# Altium schematic sheet Isolated_Oscilloscope_Diferential_Probe.SchDoc: Low Noise Oscilloscope Amplifier (part 2 of 2)
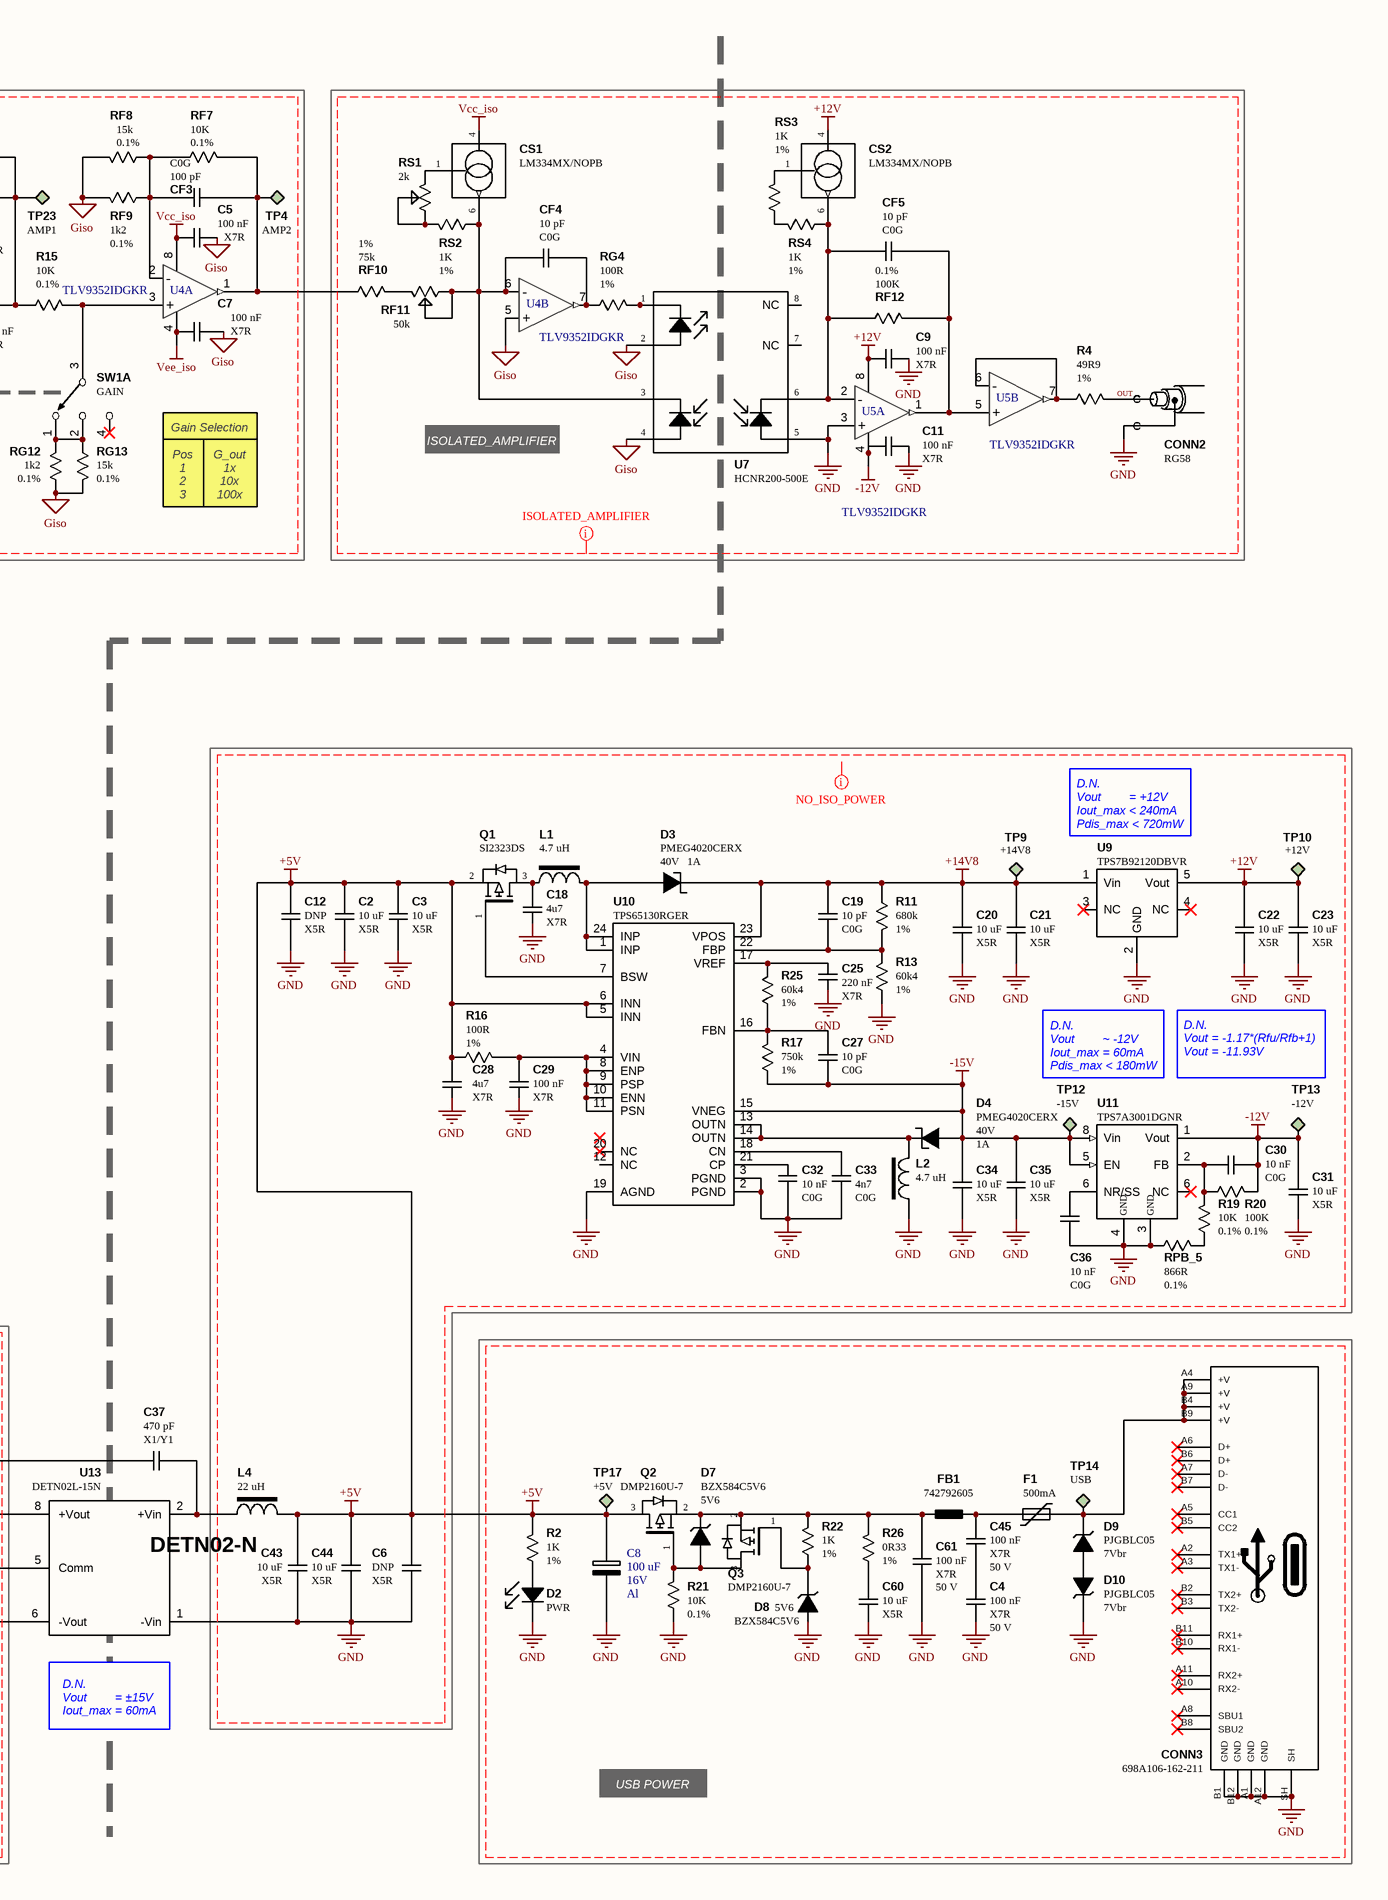
[diagram p2: Isolated_Oscilloscope_Diferential_Probe.SchDoc, right]

## Library data of the parts
C1 C4 C5 C7 C9-C11 C14 C16 C29 C45 C58 C59 C61 CF1 = Capacitor NP: 0.1 µF ±10% 50V Ceramic Capacitor X7R 0603 (1608 Metric); 04_Manufacturer Part Number: CC0603KRX7R9BB104; 06_Manufacturer: YAGEO; 01_Componente: Capacitor cerámico; 02_Montaje: SMD; 03_Encapsulado: 0603; 05_Digikey Part Number: 311-1344-1-ND; ComponentLink1Description: A_Datasheet; ComponentLink1URL: https://yageogroup.com/content/datasheet/asset/file/UPY-GPHC_X7R_6_3V-TO-250V; ComponentLink2Description: B_Digikey; Valor: 100 nF; Tolerancia: 10%
  C1 C5 C7 C9 C11 C14 C16 C29 C58 C59 CF1: ComponentLink2URL: https://www.digikey.com/en/products/detail/yageo/CC0603KRX7R9BB104/2103082?s=N4IgTCBcDaIMwEYEFoFwCztcgcgERAF0BfIA; Tensión: 50 V
  C4 C45 C61: ComponentLink2URL: https://www.digikey.com/en/products/detail/yageo/CC0603KRX7R9BB104/2103082?s=N4IgTCBcDaIMwEYEFoFwCztcgcgERAF0BfIA
  C10: ComponentLink2URL: https://www.digikey.com/en/products/detail/yageo/CC0603KRX7R9BB104/2103082?s=N4IgTCBcDaIMJwAwDZEGYDSAlAGgdiwE4AhYgRkQBYQBdAXyA; Tensión: 50 V
C2 C3 C20-C23 C31 C34 C35 C38 C39 C41 C43 C44 C47 C51-C54 C60 = Capacitor NP: 10 µF ±10% 50V Ceramic Capacitor X5R 0805 (2012 Metric); 04_Manufacturer Part Number: GRM21BR61H106KE43L; 06_Manufacturer: Murata Electronics; 01_Componente: Capacitor cerámico; 02_Montaje: SMD; 03_Encapsulado: 0805; 05_Digikey Part Number: 490-18663-1-ND; ComponentLink1Description: A_Datasheet; ComponentLink1URL: https://search.murata.co.jp/Ceramy/image/img/A01X/G101/ENG/GRM21BR61H106KE43-01A.pdf; ComponentLink2Description: B_Digikey; ComponentLink2URL: https://www.digikey.com/en/products/detail/murata-electronics/GRM21BR61H106KE43L/10326316; Valor: 10 uF; Tolerancia: 10%; Tensión: 50 V
C6 C12 = Capacitor NP: 10 µF ±10% 50V Ceramic Capacitor X5R 0805 (2012 Metric); 04_Manufacturer Part Number: GRM21BR61H106KE43L; 06_Manufacturer: Murata Electronics; 01_Componente: Capacitor cerámico; 02_Montaje: SMD; 03_Encapsulado: 0805; Valor: 10 uF; 05_Digikey Part Number: 490-18663-1-ND; ComponentLink1Description: A_Datasheet; ComponentLink1URL: https://search.murata.co.jp/Ceramy/image/img/A01X/G101/ENG/GRM21BR61H106KE43-01A.pdf; ComponentLink2Description: B_Digikey; ComponentLink2URL: https://www.digikey.com/en/products/detail/murata-electronics/GRM21BR61H106KE43L/10326316; Tolerancia: 10%; Tensión: 50 V
C8 = Capacitor Polarizado: 04_Manufacturer Part Number: 875105344010; 06_Manufacturer: Würth Elektronik; 02_Montaje: SMD; 03_Encapsulado: 6.6mmx6.6mmx5.8mm; Tolerancia: 20%; 01_Componente: Capacitor Polarizado; 05_Digikey Part Number: 732-6425-1-ND; ComponentLink1Description: A_Datasheet; ComponentLink1URL: https://www.we-online.com/components/products/datasheet/875105344010.pdf; ComponentLink2Description: B_Digikey; ComponentLink2URL: https://www.digikey.com/en/products/detail/würth-elektronik/875105344010/5147589; Valor: 100 uF
C13 C15 C17 C24 C26 C40 C50 = Capacitor NP: 04_Manufacturer Part Number: CC0805JKX7R9BB105; 06_Manufacturer: YAGEO; 01_Componente: Capacitor cerámico; 02_Montaje: SMD; 03_Encapsulado: 0805; Tolerancia: 10%; Tensión: 50V; 05_Digikey Part Number: 311-3498-1-ND; ComponentLink1Description: A_Datasheet; ComponentLink2Description: B_Digikey; Valor: 1 uF
  C13: ComponentLink1URL: https://www.yageo.com/en/Chart/Download/pdf/CC0603GRNPO9BN101; ComponentLink2URL: https://www.digikey.com/en/products/detail/yageo/CC0603GRNPO9BN101/5883538?s=N4IgTCBcDaIMJwAwDZEGYDiAlAcgBQHkBOAIRwEZFyQBdAXyA
  C15 C17 C24 C26 C40 C50: ComponentLink1URL: https://yageogroup.com/content/datasheet/asset/file/UPY-GPHC_X7R_6_3V-TO-250V; ComponentLink2URL: https://www.digikey.com/en/products/detail/yageo/CC0805JKX7R9BB105/7164382
C18 C28 C42 C46 = Capacitor NP: 4.7 µF ±20% 50V Ceramic Capacitor X7R 0805 (2012 Metric); 04_Manufacturer Part Number: GRM21BZ71H475ME15K; 06_Manufacturer: Murata Electronics; 01_Componente: Capacitor cerámico; 02_Montaje: SMD; 03_Encapsulado: 0805; 05_Digikey Part Number: 490-GRM21BZ71H475ME15KCT-ND; ComponentLink1Description: A_Datasheet; ComponentLink1URL: https://search.murata.co.jp/Ceramy/image/img/A01X/G101/ENG/GRM21BZ71H475ME15-01.pdf; ComponentLink2Description: B_Digikey; ComponentLink2URL: https://www.digikey.com/en/products/detail/murata-electronics/GRM21BZ71H475ME15K/13904866?s=N4IgTCBcDaIOICUCyYCMAhAWgdlQCQBZsBWJAUVWIGkQBdAXyA; Valor: 4u7; Tolerancia: 20%; Tensión: 50 V
C19 C27 CF4 CF5 = Capacitor NP: 10 pF ±5% 50V Ceramic Capacitor C0G, NP0 0603 (1608 Metric); 04_Manufacturer Part Number: CC0603JRNPO9BN100; 06_Manufacturer: YAGEO; 01_Componente: Capacitor cerámico; 02_Montaje: SMD; 03_Encapsulado: 0603; 05_Digikey Part Number: 311-1058-1-ND; ComponentLink1Description: A_Datasheet; ComponentLink2Description: B_Digikey; Valor: 10 pF; Tolerancia: 5%
  C19 C27: ComponentLink1URL: https://www.yageo.com/en/Chart/Download/pdf/CC0603JRNPO9BN100; ComponentLink2URL: https://www.digikey.com/en/products/detail/yageo/CC0603JRNPO9BN100/302792; Tensión: 50V
  CF4: ComponentLink1URL: https://www.yageo.com/en/Chart/Download/pdf/CC0603JRNPO9BN100; ComponentLink2URL: https://www.digikey.com/en/products/detail/yageo/CC0603JRNPO9BN100/302792; Tensión: 50 V
  CF5: ComponentLink1URL: https://yageogroup.com/content/datasheet/asset/file/UPY-GPHC_X7R_6_3V-TO-250V; ComponentLink2URL: https://www.digikey.com/en/products/detail/yageo/CC0603KRX7R9BB104/2103082?s=N4IgTCBcDaIMwEYEFoFwCztcgcgERAF0BfIA; Tensión: 50 V
C25 = Capacitor NP: 0.22 µF ±10% 25V Ceramic Capacitor X7R 0603 (1608 Metric); 04_Manufacturer Part Number: CC0603KRX7R8BB224; 06_Manufacturer: YAGEO; 01_Componente: Capacitor cerámico; 02_Montaje: SMD; 03_Encapsulado: 0603; Tensión: 50V; 05_Digikey Part Number: 311-1803-1-ND; ComponentLink1Description: A_Datasheet; ComponentLink1URL: https://yageogroup.com/content/datasheet/asset/file/UPY-GPHC_X7R_6_3V-TO-250V; ComponentLink2Description: B_Digikey; ComponentLink2URL: https://www.digikey.com/en/products/detail/yageo/CC0603KRX7R8BB224/5195211; Valor: 220 nF; Tolerancia: 10%
C30 C32 C36 C48 C49 CF_2 CF_6 = Capacitor NP: 10000 pF ±5% 50V Ceramic Capacitor C0G, NP0 0603 (1608 Metric); 04_Manufacturer Part Number: GRM1885C1H103JA01D; 06_Manufacturer: Murata Electronics; 01_Componente: Capacitor cerámico; 02_Montaje: SMD; 03_Encapsulado: 0603; 05_Digikey Part Number: 490-9666-1-ND; ComponentLink1Description: A_Datasheet; ComponentLink1URL: https://search.murata.co.jp/Ceramy/image/img/A01X/G101/ENG/GRM1885C1H103JA01-01.pdf; ComponentLink2Description: B_Digikey; Valor: 10 nF; Tolerancia: 5%; Tensión: 50V
  C30 C32 C36 C48 C49 CF_2: ComponentLink2URL: https://www.digikey.com/en/products/detail/murata-electronics/GRM1885C1H103JA01D/4421555?s=N4IgTCBcDaIOICUCyBGAHGgrAYRQCRQAYBmAKQEFCUAREAXQF8g
  CF_6: ComponentLink2URL: https://www.digikey.com/en/products/detail/murata-electronics/GRM1885C1H103JA01D/4421555
C33 = Capacitor NP: 4700 pF ±1% 50V Ceramic Capacitor C0G, NP0 0603 (1608 Metric); 04_Manufacturer Part Number: CC0603FRNPO9BN472; 06_Manufacturer: YAGEO; 01_Componente: Capacitor cerámico; 02_Montaje: SMD; 03_Encapsulado: 0603; 05_Digikey Part Number: 13-CC0603FRNPO9BN472CT-ND; ComponentLink1Description: A_Datasheet; ComponentLink1URL: https://www.yageo.com/en/Chart/Download/pdf/CC0603FRNPO9BN472; ComponentLink2Description: B_Digikey; ComponentLink2URL: https://www.digikey.com/en/products/detail/yageo/CC0603FRNPO9BN472/16797641; Valor: 4n7; Tolerancia: 1%; Tensión: 50V
C37 = Capacitor NP: 470 pF ±10% 1500V (1.5kV) Ceramic Capacitor B Radial, Disc; 04_Manufacturer Part Number: DE1B3RA471KN4AP01F; 06_Manufacturer: Murata Electronics; 01_Componente: Capacitor cerámico; 02_Montaje: THT; 03_Encapsulado: Radial Disc; 05_Digikey Part Number: 490-16186-1-ND; ComponentLink1Description: A_Datasheet; ComponentLink1URL: https://pim.murata.com/asset/pim4/ceramicCapacitorLead/DE1_RA_P01F_E_PDF_CERAMICCAPACITORLEAD?lastModifiedDatetime=20250909130219; ComponentLink2Description: B_Digikey; ComponentLink2URL: https://www.digikey.com/en/products/detail/murata-electronics/DE1B3RA471KN4AP01F/7319165; Valor: 470 pF; Tolerancia: 10%; Tensión: 1.5 kV
CA_1 CA_2 CB_1 CB_2 = Capacitor NP: -55℃~+105℃ 100V 4.7uF Metallized Polyester ±5% 插件,P=15mm Film Capacitors ROHS; 04_Manufacturer Part Number: C232A475J6SC000; 06_Manufacturer: XIAMEN FARATRONIC; 01_Componente: Capacitor cerámico; 02_Montaje: THT; 03_Encapsulado: NE; 05_Digikey Part Number: NE; ComponentLink1Description: A_Datasheet; ComponentLink2Description: B_Digikey; Valor: 4u7
  CA_1 CB_1 CB_2: ComponentLink1URL: https://www.yageo.com/en/Chart/Download/pdf/CC0603GRNPO9BN101; ComponentLink2URL: https://www.digikey.com/en/products/detail/yageo/CC0603GRNPO9BN101/5883538?s=N4IgTCBcDaIMJwAwDZEGYDiAlAcgBQHkBOAIRwEZFyQBdAXyA
  CA_2: ComponentLink1URL: https://jlcpcb.com/api/file/downloadByFileSystemAccessId/8588897352174211072
CAB1 = Capacitor NP: 5.6 pF ±0.5pF 50V Ceramic Capacitor C0G, NP0 0603 (1608 Metric); 04_Manufacturer Part Number: CC0603DRNPO9BN5R6; 06_Manufacturer: YAGEO; 01_Componente: Capacitor cerámico; 02_Montaje: SMD; 03_Encapsulado: 0603; Tolerancia: 10%; 05_Digikey Part Number: 311-3872-1-ND; ComponentLink1Description: A_Datasheet; ComponentLink1URL: https://www.yageo.com/en/Chart/Download/pdf/CC0603DRNPO9BN5R6; ComponentLink2Description: B_Digikey; ComponentLink2URL: https://www.digikey.com/en/products/detail/yageo/CC0603DRNPO9BN5R6/5883475; Valor: 5.6 pF; Tensión: 50V
CF2 CF3 CF_3 CF_4 = Capacitor NP: 04_Manufacturer Part Number: CC0603GRNPO9BN101; 06_Manufacturer: YAGEO; 01_Componente: Capacitor cerámico; 02_Montaje: SMD; 03_Encapsulado: 0603; Tolerancia: 2%; Tensión: 50V; 05_Digikey Part Number: 311-3351-1-ND; ComponentLink1Description: A_Datasheet; ComponentLink1URL: https://www.yageo.com/en/Chart/Download/pdf/CC0603GRNPO9BN101; ComponentLink2Description: B_Digikey; ComponentLink2URL: https://www.digikey.com/en/products/detail/yageo/CC0603GRNPO9BN101/5883538?s=N4IgTCBcDaIMJwAwDZEGYDiAlAcgBQHkBOAIRwEZFyQBdAXyA
  CF2 CF3 CF_4: Valor: 100 pF
  CF_3: Valor: 100n
CF_1 CF_5 = Capacitor NP: 1000 pF ±2% 50V Ceramic Capacitor C0G, NP0 0603 (1608 Metric); 04_Manufacturer Part Number: CC0603GRNPO9BN102; 06_Manufacturer: YAGEO; 01_Componente: Capacitor cerámico; 02_Montaje: SMD; 03_Encapsulado: 0603; 05_Digikey Part Number: 311-3916-1-ND; ComponentLink1Description: A_Datasheet; ComponentLink1URL: https://www.yageo.com/en/Chart/Download/pdf/CC0603GRNPO9BN102; ComponentLink2Description: B_Digikey; Valor: 1 nF; Tolerancia: 2%; Tensión: 50V
  CF_1: ComponentLink2URL: https://www.digikey.com/en/products/detail/yageo/CC0603GRNPO9BN102/5883539?s=N4IgTCBcDaIMwEYEFo4E4EDZkoHIBEQBdAXyA
  CF_5: ComponentLink2URL: https://www.digikey.com/en/products/detail/yageo/CC0603GRNPO9BN102/5883539?s=N4IgTCBcDaIMJwAwDZEGYDiAlAcgBQHkBOAIRwEZEIBdAXyA
CMRR_AC = Trimpot: 200 kOhms 0.125W, 1/8W J Lead Surface Mount Trimmer Potentiometer Cermet 11.0 Turn Top Adjustment; 04_Manufacturer Part Number: 3223W-1-204E; 06_Manufacturer: Bourns Inc.; 02_Montaje: SMD; 03_Encapsulado: J-LEAD; Tolerancia: 10%; 01_Componente: Trimpot; 05_Digikey Part Number: 3223W-1-204ECT-ND; ComponentLink1Description: A_Datasheet; ComponentLink1URL: https://www.bourns.com/docs/Product-Datasheets/3223.pdf; ComponentLink2Description: B_Digikey; ComponentLink2URL: https://www.digikey.com/en/products/detail/bourns-inc/3223W-1-204E/568954; Valor: 200k
CONN1 = Conector BNC: BNC Connector Jack, Female Socket 50 Ohms Panel Mount, Through Hole, Right Angle Solder; 06_Manufacturer: TE Connectivity Linx; 02_Montaje: SMD; Contactos: 2; Valor: 50 Ohm; 01_Componente: Conector BNC; 03_Encapsulado: BNC; 04_Manufacturer Part Number: CONBNC002; 05_Digikey Part Number: 343-CONBNC002-ND; ComponentLink1Description: A_Datasheet; ComponentLink1URL: https://www.te.com/commerce/DocumentDelivery/DDEController?Action=srchrtrv&DocNm=CONBNC002&DocType=Data+Sheet&DocLang=English&DocFormat=pdf&PartCntxt=CONBNC002; ComponentLink2Description: B_Digikey; ComponentLink2URL: https://www.digikey.com/en/products/detail/te-connectivity-linx/CONBNC002/16013841
CONN2 = RG58_Coaxial_Cable: Cable RG58 Soldado directo a PCB
CONN3 = USB C 3.0: USB-C (USB TYPE-C) USB 3.2 Gen 2 (USB 3.1 Gen 2, Superspeed + (USB 3.1)) Receptacle Connector 24 (6+18 Dummy) Position Surface Mount, Right Angle; 06_Manufacturer: Molex; 01_Componente: Conector USB C; 02_Montaje: SMD; 03_Encapsulado: USB C; Contactos: 24; TH_Paso: 0.50mm; 04_Manufacturer Part Number: 1054500101; 05_Digikey Part Number: WM12856CT-ND; ComponentLink1Description: A_Datasheet; ComponentLink1URL: https://files.edac.net/edac/content/698A/698A106-162-211%20-%20EDAC%20USB%20Connector.pdf; ComponentLink2Description: B_Digikey; ComponentLink2URL: https://www.digikey.com/en/products/detail/edac-inc/698A106-162-211/17186068
CS1 CS2 = LM334: Current Source Regulator Adjustable 8-SOIC; 06_Manufacturer: Texas Instruments; 01_Componente: Fuente de corriente; 02_Montaje: SMD; 03_Encapsulado: SOIC_8; Corriente: Adj; 04_Manufacturer Part Number: LM334MX/NOPB; 05_Digikey Part Number: LM334MX/NOPBCT-ND; ComponentLink1Description: A_Datasheet; ComponentLink1URL: https://www.ti.com/general/docs/suppproductinfo.tsp?distId=10&gotoUrl=https%3A%2F%2Fwww.ti.com%2Flit%2Fgpn%2Flm134; ComponentLink2Description: B_Digikey; ComponentLink2URL: https://www.digikey.com/en/products/detail/texas-instruments/LM334MX-NOPB/334907
D1 = Diodo TVS Bidireccional: 69.4V Clamp 8.6A Ipp Tvs Diode Surface Mount SMB; 06_Manufacturer: Littelfuse Inc.; 02_Montaje: SMD; 03_Encapsulado: DO-214AA; 01_Componente: Diodo TVS; 04_Manufacturer Part Number: SZ1SMB43AT3G; 05_Digikey Part Number: F11563CT-ND; ComponentLink1Description: A_Datasheet; ComponentLink1URL: https://www.littelfuse.com/assetdocs/littelfuse_tvs_diode_sz1smb_datasheet.pdf?assetguid=486b5b30-c6a6-4764-b97c-0bce3ce4a35d; ComponentLink2Description: B_Digikey; ComponentLink2URL: https://www.digikey.com/en/products/detail/littelfuse-inc/SZ1SMB43AT3G/3062975
D2 D5 = Diodo LED: 04_Manufacturer Part Number: SML-D12U1WT86; 06_Manufacturer: Rohm Semiconductor; 02_Montaje: SMD; 03_Encapsulado: 1608; 01_Componente: Diodo Led; 05_Digikey Part Number: SML-D12U1WT86CT-ND; ComponentLink1Description: A_Datasheet; ComponentLink1URL: https://www.rohm.com/datasheet?p=SML-D12U1W&dist=Digi-key&media=referral&source=digi-key.com&campaign=Digi-key; ComponentLink2Description: B_Digikey; ComponentLink2URL: https://www.digikey.com/en/products/detail/rohm-semiconductor/SML-D12U1WT86/5843853
D3 D4 = Diodo Schottky: Diode 40 V 2A Surface Mount SOD-123W; 06_Manufacturer: Nexperia USA Inc.; 02_Montaje: SMD; 01_Componente: Diodo Schottky; 03_Encapsulado: SOD-123; 04_Manufacturer Part Number: PMEG4020CERX; 05_Digikey Part Number: 1727-PMEG4020CERXCT-ND; ComponentLink1Description: A_Datasheet; ComponentLink2Description: B_Digikey
  D3: ComponentLink1URL: https://assets.nexperia.com/documents/data-sheet/PMEG4020CER.pdf; ComponentLink2URL: https://www.digikey.com/en/products/detail/nexperia-usa-inc/PMEG4020CERX/22050156
  D4: ComponentLink1URL: https://mm.digikey.com/Volume0/opasdata/d220001/medias/docus/661/SS12-SS16.pdf; ComponentLink2URL: https://www.digikey.com/en/products/detail/vishay-general-semiconductor-diodes-division/SS14-M3-5AT/4872626?s=N4IgTCBcDaIMpwIwBYC0BZAzAegKwEEAVEAXQF8g
D7 D8 = Diodo Zener: 04_Manufacturer Part Number: BZX584C5V6_R1_00001; 06_Manufacturer: Panjit International Inc.; 02_Montaje: SMD; 03_Encapsulado: SOD523; 01_Componente: Diodo Zener; 05_Digikey Part Number: 3757-BZX584C5V6_R1_00001CT-ND; ComponentLink1Description: A_Datasheet; ComponentLink2Description: B_Digikey
  D7: ComponentLink1URL: *; ComponentLink2URL: *
  D8: ComponentLink1URL: https://www.panjit.com.tw/upload/datasheet/BZX584C2V4_SERIES.pdf; ComponentLink2URL: https://www.digikey.com/en/products/detail/panjit-international-inc/BZX584C5V6-R1-00001/14660119
D9 D10 DP_1 DP_2 = Diodo TVS Unidireccional: 9.8V Clamp 1A (8/20µs) Ipp Tvs Diode Surface Mount SOD-323; 04_Manufacturer Part Number: PJGBLC05_R1_00001; 06_Manufacturer: Panjit International Inc.; 02_Montaje: SMD; 03_Encapsulado: SOD323; 01_Componente: Diodo TVS; 05_Digikey Part Number: 3757-PJGBLC05_R1_00001CT-ND; ComponentLink1Description: A_Datasheet; ComponentLink2Description: B_Digikey
  D9: ComponentLink1URL: *; ComponentLink2URL: *
  D10 DP_2: ComponentLink1URL: https://www.panjit.com.tw/upload/datasheet/PJGBLC03_C24C_SERIES.pdf; ComponentLink2URL: https://www.digikey.com/en/products/detail/panjit-international-inc/PJGBLC05-R1-00001/14660693
  DP_1: ComponentLink1URL: https://www.panjit.com.tw/upload/datasheet/PJGBLC03_C24C_SERIES.pdf; ComponentLink2URL: https://www.digikey.com/en/products/detail/panjit-international-inc/PJGBLC05-R1-00001/14660693?s=N4IgTCBcDaIAoCkDiAhAMgYQAwFYD6ASgIx5ZlZEgC6AvkA
F1 = Polyswitch: Polymeric PTC Resettable Fuse 15V 500 mA Ih Surface Mount 1206 (3216 Metric), Concave; 04_Manufacturer Part Number: SMD1206B025TF/24; 06_Manufacturer: YAGEO; 02_Montaje: Through Hole; 03_Encapsulado: 1206; 01_Componente: Polyswitch; 05_Digikey Part Number: 13-SMD1206B025TF/24CT-ND; ComponentLink1Description: A_Datasheet; ComponentLink1URL: https://www.yageogroup.com/content/datasheet/asset/file/SMD1210_1; ComponentLink2Description: B_Digikey; ComponentLink2URL: https://www.digikey.com/en/products/detail/yageo/SMD1210B075TF-24/15212934
FB1 = Ferrite Bead: 06_Manufacturer: Würth Elektronik; 02_Montaje: SMD; 03_Encapsulado: 0603; Z@100MHz: 33R0; Corriente: 500mA; 01_Componente: Ferrite bead; 04_Manufacturer Part Number: 742792605; 05_Digikey Part Number: 732-4661-1-ND; ComponentLink1Description: A_Datasheet; ComponentLink1URL: https://www.we-online.com/components/products/datasheet/742792605.pdf; ComponentLink2Description: B_Digikey; ComponentLink2URL: https://www.digikey.com/en/products/detail/würth-elektronik/742792605/4310414
FID1-FID3 = Fiducial: Fiducial SMD; 01_Componente: Fiducial; 02_Montaje: SMD
L1-L3 L5 = Inductor: 4.7 µH Shielded Drum Core, Wirewound Inductor 3 A 54mOhm Max Nonstandard; 04_Manufacturer Part Number: SRR4828A-4R7Y; 06_Manufacturer: Bourns Inc.; 02_Montaje: SMD; Tolerancia: 30%; Corriente: 3 A; 01_Componente: Inductor; 03_Encapsulado: Drum Core; 05_Digikey Part Number: SRR4828A-4R7YCT-ND; ComponentLink1Description: A_Datasheet; ComponentLink2Description: B_Digikey; Valor: 4.7 uH; DCR: 54 mOhm
  L1: ComponentLink1URL: https://www.bourns.com/docs/Product-Datasheets/SRR4828A.pdf; ComponentLink2URL: https://www.digikey.com/en/products/detail/bourns-inc/SRR4828A-4R7Y/7556018
  L2: ComponentLink1URL: https://www.bourns.com/docs/Product-Datasheets/SRN6045.pdf; ComponentLink2URL: https://www.digikey.com/en/products/detail/bourns-inc/SRN6045-4R7Y/2756117
  L3 L5: ComponentLink1URL: https://www.vishay.com/docs/34083/ifsc-2020de-01.pdf; ComponentLink2URL: https://www.digikey.com/en/products/detail/vishay-dale/IFSC2020DEER6R8M01/22186679
L4 = Inductor: 22 µH Shielded Drum Core, Wirewound Inductor 1.4 A 152mOhm Max Nonstandard; 04_Manufacturer Part Number: SRN5040-220M; 06_Manufacturer: Bourns Inc.; 02_Montaje: SMD; Tolerancia: 20%; Corriente: 1.4 A; 01_Componente: Inductor; 03_Encapsulado: Drum Core; 05_Digikey Part Number: SRN5040-220MCT-ND; ComponentLink1Description: A_Datasheet; ComponentLink1URL: https://www.bourns.com/docs/Product-Datasheets/SRN5040.pdf; ComponentLink2Description: B_Digikey; ComponentLink2URL: https://www.digikey.com/en/products/detail/bourns-inc/SRN5040-220M/4867717; Valor: 22 uH; DCR: 152 mOhm
MS1-MS4 = Tornillo M3: 01_Componente: Orificio M3; 02_Montaje: THT
Q1 = PMOS: P-Channel MOSFET SOT-23; 06_Manufacturer: UMW; 02_Montaje: SMD; Tensión Vds: 20 V; Corriente: 3.7 A; Potencia: 750 mW; 01_Componente: PMOS; 03_Encapsulado: SOT_23-3; 04_Manufacturer Part Number: SI2323DS; 05_Digikey Part Number: 4518-SI2323DSCT-ND; ComponentLink1Description: A_Datasheet; ComponentLink1URL: https://www.umw-ic.com/static/pdf/e1e8ff979d9611cf5a9ad984089268cb.pdf; ComponentLink2Description: B_Digikey; ComponentLink2URL: https://www.digikey.com/en/products/detail/umw/SI2323DS/24889392
Q2 Q3 = PMOS: P-Channel 20 V 3.2A (Ta) 1.4W (Ta) Surface Mount SOT-23-3; 06_Manufacturer: Diodes Incorporated; 02_Montaje: SMD; Tensión Vds: 20V; 01_Componente: PMOS; 03_Encapsulado: SOT_23-3; 04_Manufacturer Part Number: DMP2160U-7; 05_Digikey Part Number: DMP2160UDICT-ND; ComponentLink1Description: A_Datasheet; ComponentLink2Description: B_Digikey; Corriente: 3.2A; Potencia: 1.4W
  Q3: ComponentLink1URL: https://mm.digikey.com/Volume0/opasdata/d220001/medias/docus/416/DMP2160U.pdf; ComponentLink2URL: https://www.digikey.com/en/products/detail/diodes-incorporated/DMP2160U-7/2052776
R1 R2 R22 R24 RG5 RG6 RS2-RS4 = Resistor: 1 kOhms ±1% 0.1W, 1/10W Chip Resistor 0603 (1608 Metric) Thin Film; 04_Manufacturer Part Number: RT0603FRE131KL; 06_Manufacturer: YAGEO; 02_Montaje: SMD; 03_Encapsulado: 0603; 01_Componente: Resistor; 05_Digikey Part Number: 13-RT0603FRE131KLCT-ND; ComponentLink1Description: A_Datasheet; ComponentLink2Description: B_Digikey; Valor: 1K
  R1 RG5 RG6 RS2-RS4: ComponentLink1URL: https://yageogroup.com/content/datasheet/asset/file/PYU-RT_1-TO-0-01_ROHS_L; ComponentLink2URL: https://www.digikey.com/en/products/detail/yageo/RT0603FRE131KL/14008371?s=N4IgTCBcDaIEoBUAMA2JBmAYnAogRnTwGkAZEAXQF8g
  R2 R22 R24: ComponentLink1URL: https://www.seielect.com/catalog/SEI-RNCF.pdf; ComponentLink2URL: https://www.digikey.com/en/products/detail/stackpole-electronics-inc/RNCF0603BTE1K00/1710217
R4 R8 RA_1 RA_2 RB2 RB_1-RB_3 RPB_2 = Resistor: 49.9 Ohms ±1% 0.1W, 1/10W Chip Resistor 0603 (1608 Metric) Thin Film; 04_Manufacturer Part Number: RT0603FRD0749R9L; 06_Manufacturer: YAGEO; 02_Montaje: SMD; 03_Encapsulado: 0603; 01_Componente: Resistor; 05_Digikey Part Number: 13-RT0603FRD0749R9LCT-ND; ComponentLink1Description: A_Datasheet; ComponentLink1URL: https://yageogroup.com/content/datasheet/asset/file/PYU-RT_1-TO-0-01_ROHS_L; ComponentLink2Description: B_Digikey; Valor: 49R9
  R4 R8 RA_1 RA_2 RB2 RB_1-RB_3: ComponentLink2URL: https://www.digikey.com/en/products/detail/yageo/RT0603FRD0749R9L/5929087
  RPB_2: ComponentLink2URL: https://www.digikey.com/en/products/detail/yageo/RT0603FRD0749R9L/5929087?s=N4IgTCBcDaIEoBUAMA2JBmAYnAIkg7ACwCccxAMiALoC%2BQA
R5 R9 R16 RG4 = Resistor: 100 Ohms ±1% 0.1W, 1/10W Chip Resistor 0603 (1608 Metric) Thin Film; 04_Manufacturer Part Number: RT0603FRE13100RL; 06_Manufacturer: YAGEO; 02_Montaje: SMD; 03_Encapsulado: 0603; 01_Componente: Resistor; 05_Digikey Part Number: 13-RT0603FRE13100RLCT-ND; ComponentLink1Description: A_Datasheet; ComponentLink1URL: https://yageogroup.com/content/datasheet/asset/file/PYU-RT_1-TO-0-01_ROHS_L; ComponentLink2Description: B_Digikey; Valor: 100R
  R5 R9: ComponentLink2URL: https://www.digikey.com/en/products/detail/yageo/RT0603FRE13100RL/14008216
  R16 RG4: ComponentLink2URL: https://www.digikey.com/en/products/detail/yageo/RT0603FRE13100RL/14008216?s=N4IgTCBcDaIEoBUAMA2JBmAYnAogRnTySTgBkQBdAXyA
R6 R14 R15 R19 R21 RA_4 RB_4 RF1-RF4 RF7 RPB_3 = Resistor: 10 kOhms ±0.1% 0.1W, 1/10W Chip Resistor 0603 (1608 Metric) Thin Film; 04_Manufacturer Part Number: RT0603BRD0710KL; 06_Manufacturer: YAGEO; 02_Montaje: SMD; 03_Encapsulado: 0603; 01_Componente: Resistor; 05_Digikey Part Number: YAG1236CT-ND; ComponentLink1Description: A_Datasheet; ComponentLink1URL: https://yageogroup.com/content/datasheet/asset/file/PYU-RT_1-TO-0-01_ROHS_L; ComponentLink2Description: B_Digikey; Valor: 10K
  R6 R14 R15 R19 R21 RA_4 RB_4 RF1-RF4 RF7: ComponentLink2URL: https://www.digikey.com/en/products/detail/yageo/RT0603FRE0710KL/1075040?s=N4IgTCBcDaIEoBUAMA2JBmAYnAokg7AIxIDSAMiALoC%2BQA
  RPB_3: ComponentLink2URL: https://www.digikey.com/en/products/detail/yageo/RT0603BRD0710KL/1072198
R10 R18 = Resistor: 24.9 kOhms ±1% 0.1W, 1/10W Chip Resistor 0603 (1608 Metric) Thick Film; 04_Manufacturer Part Number: RC0603FR-1024K9L; 06_Manufacturer: YAGEO; 02_Montaje: SMD; 03_Encapsulado: 0603; 01_Componente: Resistor; 05_Digikey Part Number: 13-RC0603FR-1024K9LCT-ND; ComponentLink1Description: A_Datasheet; ComponentLink2Description: B_Digikey; Valor: 24k9
  R10: ComponentLink1URL: https://yageogroup.com/content/datasheet/asset/file/PYU-RC_GROUP_51_ROHS_L; ComponentLink2URL: https://www.digikey.com/en/products/detail/yageo/RC0603FR-1024K9L/14008263
  R18: ComponentLink1URL: https://yageogroup.com/content/datasheet/asset/file/PYU-RT_1-TO-0-01_ROHS_L; ComponentLink2URL: https://www.digikey.com/en/products/detail/yageo/RT0603FRE0710KL/1075040?s=N4IgTCBcDaIEoBUAMA2JBmAYnAokg7AIxIDSAMiALoC%2BQA
R11 = Resistor: 680 kOhms ±1% 0.1W, 1/10W Chip Resistor 0603 (1608 Metric) Moisture Resistant Thick Film; 04_Manufacturer Part Number: 311-680KHRCT-ND; 06_Manufacturer: YAGEO; 02_Montaje: SMD; 03_Encapsulado: 0603; 01_Componente: Resistor; 05_Digikey Part Number: RC0603FR-07680KL; ComponentLink1Description: A_Datasheet; ComponentLink1URL: https://yageogroup.com/content/datasheet/asset/file/PYU-RC_GROUP_51_ROHS_L; ComponentLink2Description: B_Digikey; ComponentLink2URL: https://www.digikey.com/en/products/detail/yageo/RC0603FR-07680KL/727356; Valor: 680k
R12 R20 RF12 = Resistor: 100 kOhms ±0.1% 0.1W, 1/10W Chip Resistor 0603 (1608 Metric) Thin Film; 04_Manufacturer Part Number: RT0603BRD07100KL; 06_Manufacturer: YAGEO; 02_Montaje: SMD; 03_Encapsulado: 0603; 01_Componente: Resistor; 05_Digikey Part Number: YAG1235CT-ND; ComponentLink1Description: A_Datasheet; ComponentLink1URL: https://yageogroup.com/content/datasheet/asset/file/PYU-RT_1-TO-0-01_ROHS_L; ComponentLink2Description: B_Digikey; ComponentLink2URL: https://www.digikey.com/en/products/detail/yageo/RT0603FRE0710KL/1075040?s=N4IgTCBcDaIEoBUAMA2JBmAYnAokg7AIxIDSAMiALoC%2BQA; Valor: 100K
R13 R25 = Resistor: 60.4 kOhms ±1% 0.1W, 1/10W Chip Resistor 0603 (1608 Metric) Moisture Resistant Thick Film; 04_Manufacturer Part Number: RC0603FR-0760K4L; 06_Manufacturer: YAGEO; 02_Montaje: SMD; 03_Encapsulado: 0603; 01_Componente: Resistor; 05_Digikey Part Number: 311-60.4KHRCT-ND; ComponentLink1Description: A_Datasheet; ComponentLink1URL: https://yageogroup.com/content/datasheet/asset/file/PYU-RC_GROUP_51_ROHS_L; ComponentLink2Description: B_Digikey; ComponentLink2URL: https://www.digikey.com/en/products/detail/yageo/RC0603FR-0760K4L/727328; Valor: 60k4
R17 = Resistor: 750 kOhms ±1% 0.1W, 1/10W Chip Resistor 0603 (1608 Metric) Moisture Resistant Thick Film; 04_Manufacturer Part Number: RC0603FR-07750KL; 06_Manufacturer: YAGEO; 02_Montaje: SMD; 03_Encapsulado: 0603; 01_Componente: Resistor; 05_Digikey Part Number: 311-750KHRCT-ND; ComponentLink1Description: A_Datasheet; ComponentLink1URL: https://yageogroup.com/content/datasheet/asset/file/PYU-RC_GROUP_51_ROHS_L; ComponentLink2Description: B_Digikey; ComponentLink2URL: https://www.digikey.com/en/products/detail/yageo/RC0603FR-07750KL/727380; Valor: 750k
R23 R31 = Resistor: 04_Manufacturer Part Number: RT0603FRE073R9L; 06_Manufacturer: YAGUEO; 02_Montaje: SMD; 03_Encapsulado: 0603; 01_Componente: Resistor; 05_Digikey Part Number: 13-RT0603FRE073R9LCT-ND; ComponentLink1Description: A_Datasheet; ComponentLink1URL: https://yageogroup.com/content/datasheet/asset/file/PYU-RT_1-TO-0-01_ROHS_L; ComponentLink2Description: B_Digikey; ComponentLink2URL: https://www.digikey.com/en/products/detail/yageo/RT0603FRE073R9L/5929173; Valor: 3R9
R26 = Resistor: 330 mOhms ±1% 0.1W, 1/10W Chip Resistor 0603 (1608 Metric) Current Sense Thick Film; 04_Manufacturer Part Number: RL0603FR-070R33L; 06_Manufacturer: YAGUEO; 02_Montaje: SMD; 03_Encapsulado: 0603; 01_Componente: Resistor; 05_Digikey Part Number: 311-.33QCT-ND; ComponentLink1Description: A_Datasheet; ComponentLink1URL: https://yageogroup.com/content/Resource%20Library/Datasheet/PYU-RL_GROUP_521_ROHS_L.pdf; ComponentLink2Description: B_Digikey; ComponentLink2URL: https://www.digikey.com/en/products/detail/yageo/RL0603FR-070R33L/1037107; Valor: 0R33
RA_3 RA_5 = Trimpot: 100 Ohms 0.25W, 1/4W J Lead Surface Mount Trimmer Potentiometer Cermet 11.0 Turn Top Adjustment; 04_Manufacturer Part Number: PVG5A101C03R00; 06_Manufacturer: Bourns Inc.; 02_Montaje: SMD; 03_Encapsulado: J-LEAD; Tolerancia: 10%; 01_Componente: Trimpot; 05_Digikey Part Number: 490-2659-1-ND; ComponentLink1Description: A_Datasheet; ComponentLink1URL: https://www.bourns.com/docs/Product-Datasheets/pvg5.pdf; ComponentLink2Description: B_Digikey; ComponentLink2URL: https://www.digikey.com/en/products/detail/bourns-inc/PVG5A102C03R00/666287; Valor: 100R
RAB_1 RAB_2 = Resistor: 1 MOhms ±0.1% 0.1W, 1/10W Chip Resistor 0603 (1608 Metric) Thin Film; 04_Manufacturer Part Number: RT0603BRD071ML; 06_Manufacturer: YAGEO; 02_Montaje: SMD; 03_Encapsulado: 0603; 01_Componente: Resistor; 05_Digikey Part Number: YAG4498CT-ND; ComponentLink1Description: A_Datasheet; ComponentLink1URL: https://yageogroup.com/content/datasheet/asset/file/PYU-RT_1-TO-0-01_ROHS_L; ComponentLink2Description: B_Digikey; ComponentLink2URL: https://www.digikey.com/en/products/detail/yageo/RT0603BRD071ML/5927906; Valor: 1M
RF5 RF8 RG8 RG13 = Resistor: 15 kOhms ±0.1% 0.1W, 1/10W Chip Resistor 0603 (1608 Metric) Thin Film; 04_Manufacturer Part Number: RT0603BRD0715KL; 06_Manufacturer: YAGEO; 02_Montaje: SMD; 03_Encapsulado: 0603; 01_Componente: Resistor; 05_Digikey Part Number: YAG1538CT-ND; ComponentLink1Description: A_Datasheet; ComponentLink2Description: B_Digikey; Valor: 15k
  RF5: ComponentLink1URL: https://yageogroup.com/content/datasheet/asset/file/PYU-RC_GROUP_51_ROHS_L; ComponentLink2URL: https://www.digikey.com/en/products/detail/yageo/RC0603FR-0715KL/726953
  RF8: ComponentLink1URL: https://www.digikey.com/en/products/detail/yageo/RC0603FR-071K2L/726852; ComponentLink2URL: https://yageogroup.com/content/datasheet/asset/file/PYU-RC_GROUP_51_ROHS_L
  RG8 RG13: ComponentLink1URL: https://yageogroup.com/content/datasheet/asset/file/PYU-RT_1-TO-0-01_ROHS_L; ComponentLink2URL: https://www.digikey.com/en/products/detail/yageo/RT0603BRD0715KL/1072265
RF6 RF9 RG7 RG12 = Resistor: 1.2 kOhms ±0.1% 0.1W, 1/10W Chip Resistor 0603 (1608 Metric) Thin Film; 04_Manufacturer Part Number: RT0603BRD071K2L; 06_Manufacturer: YAGEO; 02_Montaje: SMD; 03_Encapsulado: 0603; 01_Componente: Resistor; 05_Digikey Part Number: YAG1563CT-ND; ComponentLink1Description: A_Datasheet; ComponentLink2Description: B_Digikey; Valor: 1k2
  RF6: ComponentLink1URL: https://www.digikey.com/en/products/detail/yageo/RC0603FR-071K2L/726852; ComponentLink2URL: https://yageogroup.com/content/datasheet/asset/file/PYU-RC_GROUP_51_ROHS_L
  RF9: ComponentLink1URL: https://yageogroup.com/content/datasheet/asset/file/PYU-RT_1-TO-0-01_ROHS_L; ComponentLink2URL: https://www.digikey.com/en/products/detail/yageo/RT0603BRD071K2L/1072323
  RG7 RG12: ComponentLink1URL: https://yageogroup.com/content/datasheet/asset/file/PYU-RT_1-TO-0-01_ROHS_L; ComponentLink2URL: https://www.digikey.com/en/products/detail/yageo/RT0603FRE131KL/14008371?s=N4IgTCBcDaIEoBUAMA2JBmAYnAogRnTwGkAZEAXQF8g
RF10 = Resistor: 75 kOhms ±1% 0.1W, 1/10W Chip Resistor 0603 (1608 Metric) Moisture Resistant Thick Film; 04_Manufacturer Part Number: RC0603FR-0775KL; 06_Manufacturer: YAGEO; 02_Montaje: SMD; 03_Encapsulado: 0603; 01_Componente: Resistor; 05_Digikey Part Number: 311-75.0KHRCT-ND; ComponentLink1Description: A_Datasheet; ComponentLink1URL: https://yageogroup.com/content/datasheet/asset/file/PYU-RC_GROUP_51_ROHS_L; ComponentLink2Description: B_Digikey; ComponentLink2URL: https://www.digikey.com/en/products/detail/yageo/RC0603FR-0775KL/727378; Valor: 75k
RF11 = Trimpot: 50 kOhms 0.25W, 1/4W J Lead Surface Mount Trimmer Potentiometer Cermet 5.0 Turn Top Adjustment; 04_Manufacturer Part Number: 3214W-1-503G; 06_Manufacturer: Bourns Inc.; 02_Montaje: SMD; 03_Encapsulado: J-LEAD; Tolerancia: 10%; 01_Componente: Trimpot; 05_Digikey Part Number: 118-3214W-1-503GCT-ND; ComponentLink1Description: A_Datasheet; ComponentLink1URL: https://www.bourns.com/docs/Product-Datasheets/3214.pdf; ComponentLink2Description: B_Digikey; ComponentLink2URL: https://www.digikey.com/en/products/detail/bourns-inc/3214W-1-503G/2535184?s=N4IgTCBcDaIIxwBwFoDMY4BYDqy7IFYAGVAcQGEAVZAOQBEQBdAXyA; Valor: 50k
RG1 = Resistor: 5.49 kOhms ±0.1% 0.1W, 1/10W Chip Resistor 0603 (1608 Metric) Thin Film; 04_Manufacturer Part Number: RT0603BRD075K49L; 06_Manufacturer: YAGEO; 02_Montaje: SMD; 03_Encapsulado: 0603; 01_Componente: Resistor; 05_Digikey Part Number: YAG1698CT-ND; ComponentLink1Description: A_Datasheet; ComponentLink1URL: https://yageogroup.com/content/datasheet/asset/file/PYU-RT_1-TO-0-01_ROHS_L; ComponentLink2Description: B_Digikey; ComponentLink2URL: https://www.digikey.com/en/products/detail/yageo/RT0603BRD075K49L/1072595?s=N4IgjCBcoMxaBjKAzAhgGwM4FMA0IB7KAbRAHYYIBdfABwBcoQBlegJwEsA7AcxAF98YAGzwQSSGix5CJEDACcAJgAsomiAZNWnXgPxKADAA4ArGIlSc%2BIpFKmAdCoUACANYB5ABYBbTCA0tSBAAVS4Oeg9kAFlsVEwAVzZsfRAAWnNocRQMa1k7ECUQfDgqQXSirIl2BJlbUgUA8rS4KqgaurkwQyb8NNE2yA6bOVLmxsHh-NJqZohBq06CsDHygdAOABMmNO6IOkZg4pB6AE9aFOD4pH5%2BIA; Valor: 5k49
RPB_1 RPB_4 RPB_5 = Resistor: 866 Ohms ±1% 0.1W, 1/10W Chip Resistor 0603 (1608 Metric) Thin Film; 04_Manufacturer Part Number: RT0603BRD07866RL; 06_Manufacturer: YAGEO; 02_Montaje: SMD; 03_Encapsulado: 0603; 01_Componente: Resistor; 05_Digikey Part Number: YAG1741CT-ND; ComponentLink1Description: A_Datasheet; ComponentLink1URL: https://yageogroup.com/content/datasheet/asset/file/PYU-RT_1-TO-0-01_ROHS_L; ComponentLink2Description: B_Digikey; ComponentLink2URL: https://www.digikey.com/en/products/detail/yageo/RT0603BRD07866RL/1072664?s=N4IgjCBcoMxaBjKAzAhgGwM4FMA0IB7KAbRAHYYIBdfABwBcoQBlegJwEsA7AcxAF98YAGzwQSSGix5CJEDACcAJgAsomiAZNWnXgPxKADAA4ArGK2QQAVS4d6AeWQBZbKkwBXNthD4PTBwALAFtMXxBg7iZjYVF8YNQAD2jY-RAAWnNocRQMHHwiSFI4AxAqQQyIbIkpfNki8Dhy-HSlMQl2DxlC0gUyivTRaqhO7rkmgb7hyFGCuWoBuGnZ%2BtIwQ37%2BfiA; Valor: 866R
RS1 TR3 = Trimpot: 2 kOhms 0.25W, 1/4W J Lead Surface Mount Trimmer Potentiometer Cermet 5.0 Turn Top Adjustment; 04_Manufacturer Part Number: 3214W-1-202G; 06_Manufacturer: Bourns Inc.; 02_Montaje: SMD; 03_Encapsulado: J-LEAD; Tolerancia: 10%; 01_Componente: Trimpot; 05_Digikey Part Number: 118-3214W-1-202GCT-ND; ComponentLink1Description: A_Datasheet; ComponentLink1URL: https://www.bourns.com/docs/Product-Datasheets/3214.pdf; ComponentLink2Description: B_Digikey; ComponentLink2URL: https://www.digikey.com/en/products/detail/bourns-inc/3214W-1-202G/2535177; Valor: 2k
SW1 SW3 = EG2301B-ND: 2P3T; 04_Manufacturer Part Number: E-Switch; 01_Componente: Switch; 02_Montaje: THM; 03_Encapsulado: NA; 05_Digikey Part Number: EG2301B-ND; 06_Manufacturer: E-Switch; ComponentLink1Description: A_Datasheet; ComponentLink1URL: https://configured-product-images.s3.amazonaws.com/Datasheets/EG.pdf; ComponentLink2Description: B_Digikey; ComponentLink2URL: https://www.digikey.com/en/products/detail/e-switch/EG2301B/1804477?s=N4IgTCBcDaIKIHEwGYAMBGAQiAugXyA
SW2 SW4 = EG2201B: Slide Switch DPDT Through Hole; 06_Manufacturer: E-Switch; 02_Montaje: THT; 03_Encapsulado: NA; 01_Componente: Switch; 04_Manufacturer Part Number: EG2201B; 05_Digikey Part Number: EG2201B-ND; ComponentLink1Description: 01_Digikey; ComponentLink1URL: https://www.digikey.com/en/products/detail/e-switch/EG2201B/1804465; ComponentLink2Description: 02_Datasheet; ComponentLink2URL: https://configured-product-images.s3.amazonaws.com/Datasheets/EG.pdf
TP1-TP23 = TestPoint_SMD: Testpoint; 01_Componente: Test_Point; 02_Montaje: THT; 03_Encapsulado: NA; 04_Manufacturer Part Number: NA; 05_Digikey Part Number: NA; ComponentLink1Description: A_Datasheet; ComponentLink1URL: NA; ComponentLink2Description: B_Digikey; ComponentLink2URL: NA
TR4 = Trimpot: 10 kOhms ±0.1% 0.1W, 1/10W Chip Resistor 0603 (1608 Metric) Thin Film; 04_Manufacturer Part Number: RT0603BRD0710KL; 06_Manufacturer: YAGEO; 02_Montaje: SMD; 03_Encapsulado: 0603; 01_Componente: Resistor; 05_Digikey Part Number: YAG1236CT-ND; ComponentLink1Description: A_Datasheet; ComponentLink1URL: https://tech.alpsalpine.com/e/products/detail/RK09K1130081/; ComponentLink2Description: B_Digikey; ComponentLink2URL: https://www.digikey.com/en/products/detail/alps-alpine/RK09K1130081/21721573; Valor: 10K; Tolerancia: 0.1%
U1 = INA826AIDR: Instrumentation Amplifier 1 Circuit Rail-to-Rail 8-SOIC; 06_Manufacturer: Texas Instruments; 01_Componente: Amplificador operacional de instrumentación; 02_Montaje: SMD; 03_Encapsulado: SOIC_8; 04_Manufacturer Part Number: INA826AIDR; 05_Digikey Part Number: 296-30238-1-ND; ComponentLink1Description: A_Datasheet; ComponentLink1URL: https://www.ti.com/general/docs/suppproductinfo.tsp?distId=10&gotoUrl=https%3A%2F%2Fwww.ti.com%2Flit%2Fgpn%2Fina826; ComponentLink2Description: B_Digikey; ComponentLink2URL: https://www.digikey.com/en/products/detail/texas-instruments/INA826AIDR/2833524
U2-U5 = Amplificador Operacional Doble: Standard (General Purpose) Amplifier 2 Circuit Rail-to-Rail 8-VSSOP; 06_Manufacturer: Texas Instruments; 02_Montaje: SMD; 03_Encapsulado: VSSOP_8; 01_Componente: Amplificador operacional doble; 04_Manufacturer Part Number: TLV9352IDGKR; 05_Digikey Part Number: 296-TLV9352IDGKRCT-ND; ComponentLink1Description: A_Datasheet; ComponentLink2Description: B_Digikey
  U2: ComponentLink1URL: *; ComponentLink2URL: *
  U3-U5: ComponentLink1URL: https://www.ti.com/lit/ds/symlink/tlv9352.pdf; ComponentLink2URL: https://www.digikey.com/en/products/detail/texas-instruments/TLV9352IDGKR/15857241
U7 = HCNR200: Optoisolator Photovoltaic, Linearized Output 5000Vrms 1 Channel 8-DIP Gull Wing; 06_Manufacturer: Broadcom Limited; 02_Montaje: SMD; 03_Encapsulado: DIP Gull Wing_8; 01_Componente: HCNR200-500E; 04_Manufacturer Part Number: HCNR200-500E; 05_Digikey Part Number: 516-4038-1-ND; ComponentLink1Description: A_Datasheet; ComponentLink1URL: https://docs.broadcom.com/doc/HCNR200-HCNR201-High-Linearity-Analog-Optocouplers-DS; ComponentLink2Description: B_Digikey; ComponentLink2URL: https://www.digikey.com/en/products/detail/broadcom-limited/HCNR200-500E/1234328
U9 U12 = TPS7B92120DBVR: Linear Voltage Regulator IC Positive Fixed 1 Output 300mA SOT-23-5; 06_Manufacturer: Texas Instruments; 01_Componente: LDO; 02_Montaje: SMD; Tensión: 12 V; Potencia: 1.375 W; 03_Encapsulado: SOT_23-5; 04_Manufacturer Part Number: TPS7B92120DBVR; 05_Digikey Part Number: 296-TPS7B92120DBVRCT-ND; ComponentLink1Description: A_Datasheet; ComponentLink1URL: https://www.ti.com/lit/ds/symlink/tps7b92.pdf?ts=1715825496404&ref_url=https%253A%252F%252Fwww.ti.com%252Fproduct%252FTPS7B92%253Fjktype%253Dhomepageproduct; ComponentLink2Description: B_Digikey; ComponentLink2URL: https://www.digikey.com/en/products/detail/texas-instruments/TPS7B92120DBVR/23331459; Corriente: 300 mA
U10 = TPS65130RGER: Boost, Buck-Boost Switching Regulator IC Positive and Negative (Dual Rail) Adjustable 3.2V, -2V 2 Output 700mA (Switch) 24-VFQFN Exposed Pad; 06_Manufacturer: Texas Instruments; 01_Componente: DC/DC; 02_Montaje: SMD; Tensión nominal: Adj; Corriente de salida: 1A; Potencia de salida: N.E.; 03_Encapsulado: VFQN_24; 04_Manufacturer Part Number: TPS65130RGER; 05_Digikey Part Number: 296-17080-1-ND; ComponentLink1Description: A_Datasheet; ComponentLink1URL: https://www.ti.com/general/docs/suppproductinfo.tsp?distId=10&gotoUrl=https%3A%2F%2Fwww.ti.com%2Flit%2Fgpn%2Ftps65130; ComponentLink2Description: B_Digikey; ComponentLink2URL: https://www.digikey.com/en/products/detail/texas-instruments/TPS65130RGER/660211
U11 U16 = TPS7A3001DGNR: Linear Voltage Regulator IC Negative Adjustable 1 Output 200mA 8-HVSSOP; 06_Manufacturer: Texas Instruments; 01_Componente: LDO; 02_Montaje: SMD; 03_Encapsulado: HVSSOP_8; Tensión nominal: Adj; Potencia: N.E.; 04_Manufacturer Part Number: TPS7A3001DGNR; 05_Digikey Part Number: 296-27750-1-ND; ComponentLink1Description: A_Datasheet; ComponentLink1URL: https://www.ti.com/lit/ds/symlink/tps7a30.pdf?HQS=dis-dk-null-digikeymode-dsf-pf-null-wwe&ts=1776483144075&ref_url=https%253A%252F%252Fwww.ti.com%252Fgeneral%252Fdocs%252Fsuppproductinfo.tsp%253FdistId%253D10%2526gotoUrl%253Dhttps%253A%252F%252Fwww.ti.com%252Flit%252Fgpn%252Ftps7a30; ComponentLink2Description: B_Digikey; ComponentLink2URL: https://www.digikey.com/en/products/detail/texas-instruments/TPS7A3001DGNR/2361060; Corriente de salida: 200 mA
U13 = DETN02-N: Isolated Module DC DC Converter 2 Output 15V -15V 66mA, 66mA 4.5V - 5.5V Input; 06_Manufacturer: MEAN WELL USA Inc.; 01_Componente: DC/DC Converter; 02_Montaje: SMD; 03_Encapsulado: SMD-12; Potencia: 1W; 04_Manufacturer Part Number: DETN02L-15N; 05_Digikey Part Number: 1866-DETN02L-15N-ND; ComponentLink1Description: A_Datasheet; ComponentLink1URL: https://www.meanwellusa.com/webapp/product/search.aspx?prod=DETN02-N; ComponentLink2Description: B_Digikey; ComponentLink2URL: https://www.digikey.com/en/products/detail/mean-well-usa-inc/DETN02L-15N/22119213; Tensión: ±15 V; Corriente: ± 66 mA
U14 U15 = TL431: Shunt Voltage Reference IC Adjustable 2.495V 36 VV ±0.5% 100 mA SOT-23-3; 06_Manufacturer: Texas Instruments; 01_Componente: Referencia de tensión; 02_Montaje: SMD; Tensión: 2.5 V; Corriente: 100 mA; 03_Encapsulado: SOT_23-3; 04_Manufacturer Part Number: TL431BIDBZR; 05_Digikey Part Number: 296-18872-1-ND; ComponentLink1Description: A_Datasheet; ComponentLink1URL: https://www.ti.com/lit/ds/symlink/tl431.pdf?ts=1708404301053&ref_url=https%253A%252F%252Fwww.ti.com%252Fproduct%252FTL431%253FkeyMatch%253D%2526tisearch%253Dsearch-everything%2526usecase%253Dpartmatches; ComponentLink2Description: B_Digikey; ComponentLink2URL: https://www.digikey.com/en/products/detail/texas-instruments/TL431BIDBZR/863704